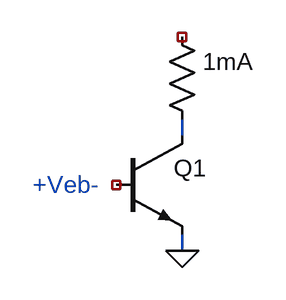
[diagram p0: schematic 4.asc]
4.asc, the LTspice schematic file:
Version 4
SHEET 1 880 680
WIRE 208 112 208 96
WIRE 208 224 208 208
FLAG 208 224 0
SYMBOL npn 144 112 R0
SYMATTR InstName Q1
SYMATTR Value ""
SYMBOL res 192 0 R0
SYMATTR InstName 1mA
SYMATTR Value ""
TEXT 128 160 Right 2 ;+Veb-

The netlist it stands for:
* 4.asc
Q1 N001 NC_01 0 0
R§1mA NC_02 N001
.model NPN NPN
.model PNP PNP
.lib standard.bjt
* +Veb-
.backanno
.end